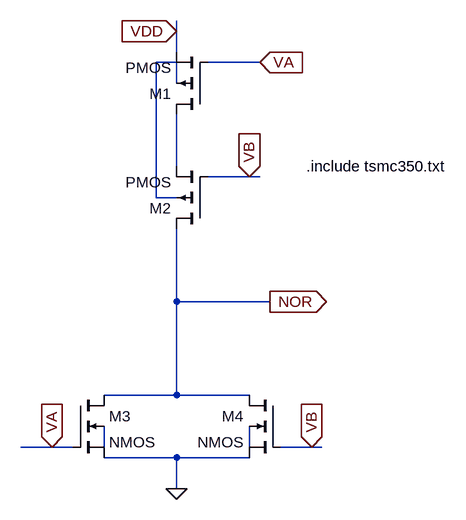
[diagram p0: schematic NOR.asc]
NOR.asc, the LTspice schematic file:
Version 4
SHEET 1 908 680
WIRE 480 -160 480 -176
WIRE 480 -128 480 -160
WIRE 480 -112 448 -112
WIRE 608 -112 528 -112
WIRE 480 -80 480 -112
WIRE 480 48 480 -32
WIRE 592 64 528 64
WIRE 608 64 592 64
WIRE 448 96 448 -112
WIRE 480 96 448 96
WIRE 480 256 480 144
WIRE 624 256 480 256
WIRE 480 400 480 256
WIRE 480 400 368 400
WIRE 592 400 480 400
WIRE 288 480 240 480
WIRE 320 480 288 480
WIRE 368 480 368 448
WIRE 592 480 592 448
WIRE 688 480 640 480
WIRE 704 480 688 480
WIRE 480 496 368 496
WIRE 592 496 480 496
WIRE 480 544 480 496
FLAG 480 544 0
FLAG 480 -160 VDD
IOPIN 480 -160 In
FLAG 608 -112 VA
IOPIN 608 -112 In
FLAG 592 64 VB
IOPIN 592 64 In
FLAG 288 480 VA
IOPIN 288 480 In
FLAG 688 480 VB
IOPIN 688 480 In
FLAG 624 256 NOR
IOPIN 624 256 Out
SYMBOL pmos4 528 -32 R180
SYMATTR InstName M1
SYMATTR Value2 l=350n w=30u
SYMBOL pmos4 528 144 R180
SYMATTR InstName M2
SYMATTR Value2 l=350n w=30u
SYMBOL nmos4 320 400 R0
SYMATTR InstName M3
SYMATTR Value2 l=350n w=8u
SYMBOL nmos4 640 400 M0
SYMATTR InstName M4
SYMATTR Value2 l=350n w=8u
TEXT 680 48 Left 2 !.include tsmc350.txt

The netlist it stands for:
* NOR.asc
M1 N002 VA VDD N001 PMOS l=350n w=30u
M2 NOR VB N002 N001 PMOS l=350n w=30u
M3 NOR VA 0 N003 NMOS l=350n w=8u
M4 NOR VB 0 N004 NMOS l=350n w=8u
.model NMOS NMOS
.model PMOS PMOS
.lib standard.mos
.include tsmc350.txt
.backanno
.end